# EAGLE design PowerManagementMysensors2 (EAGLE 6.5.0)
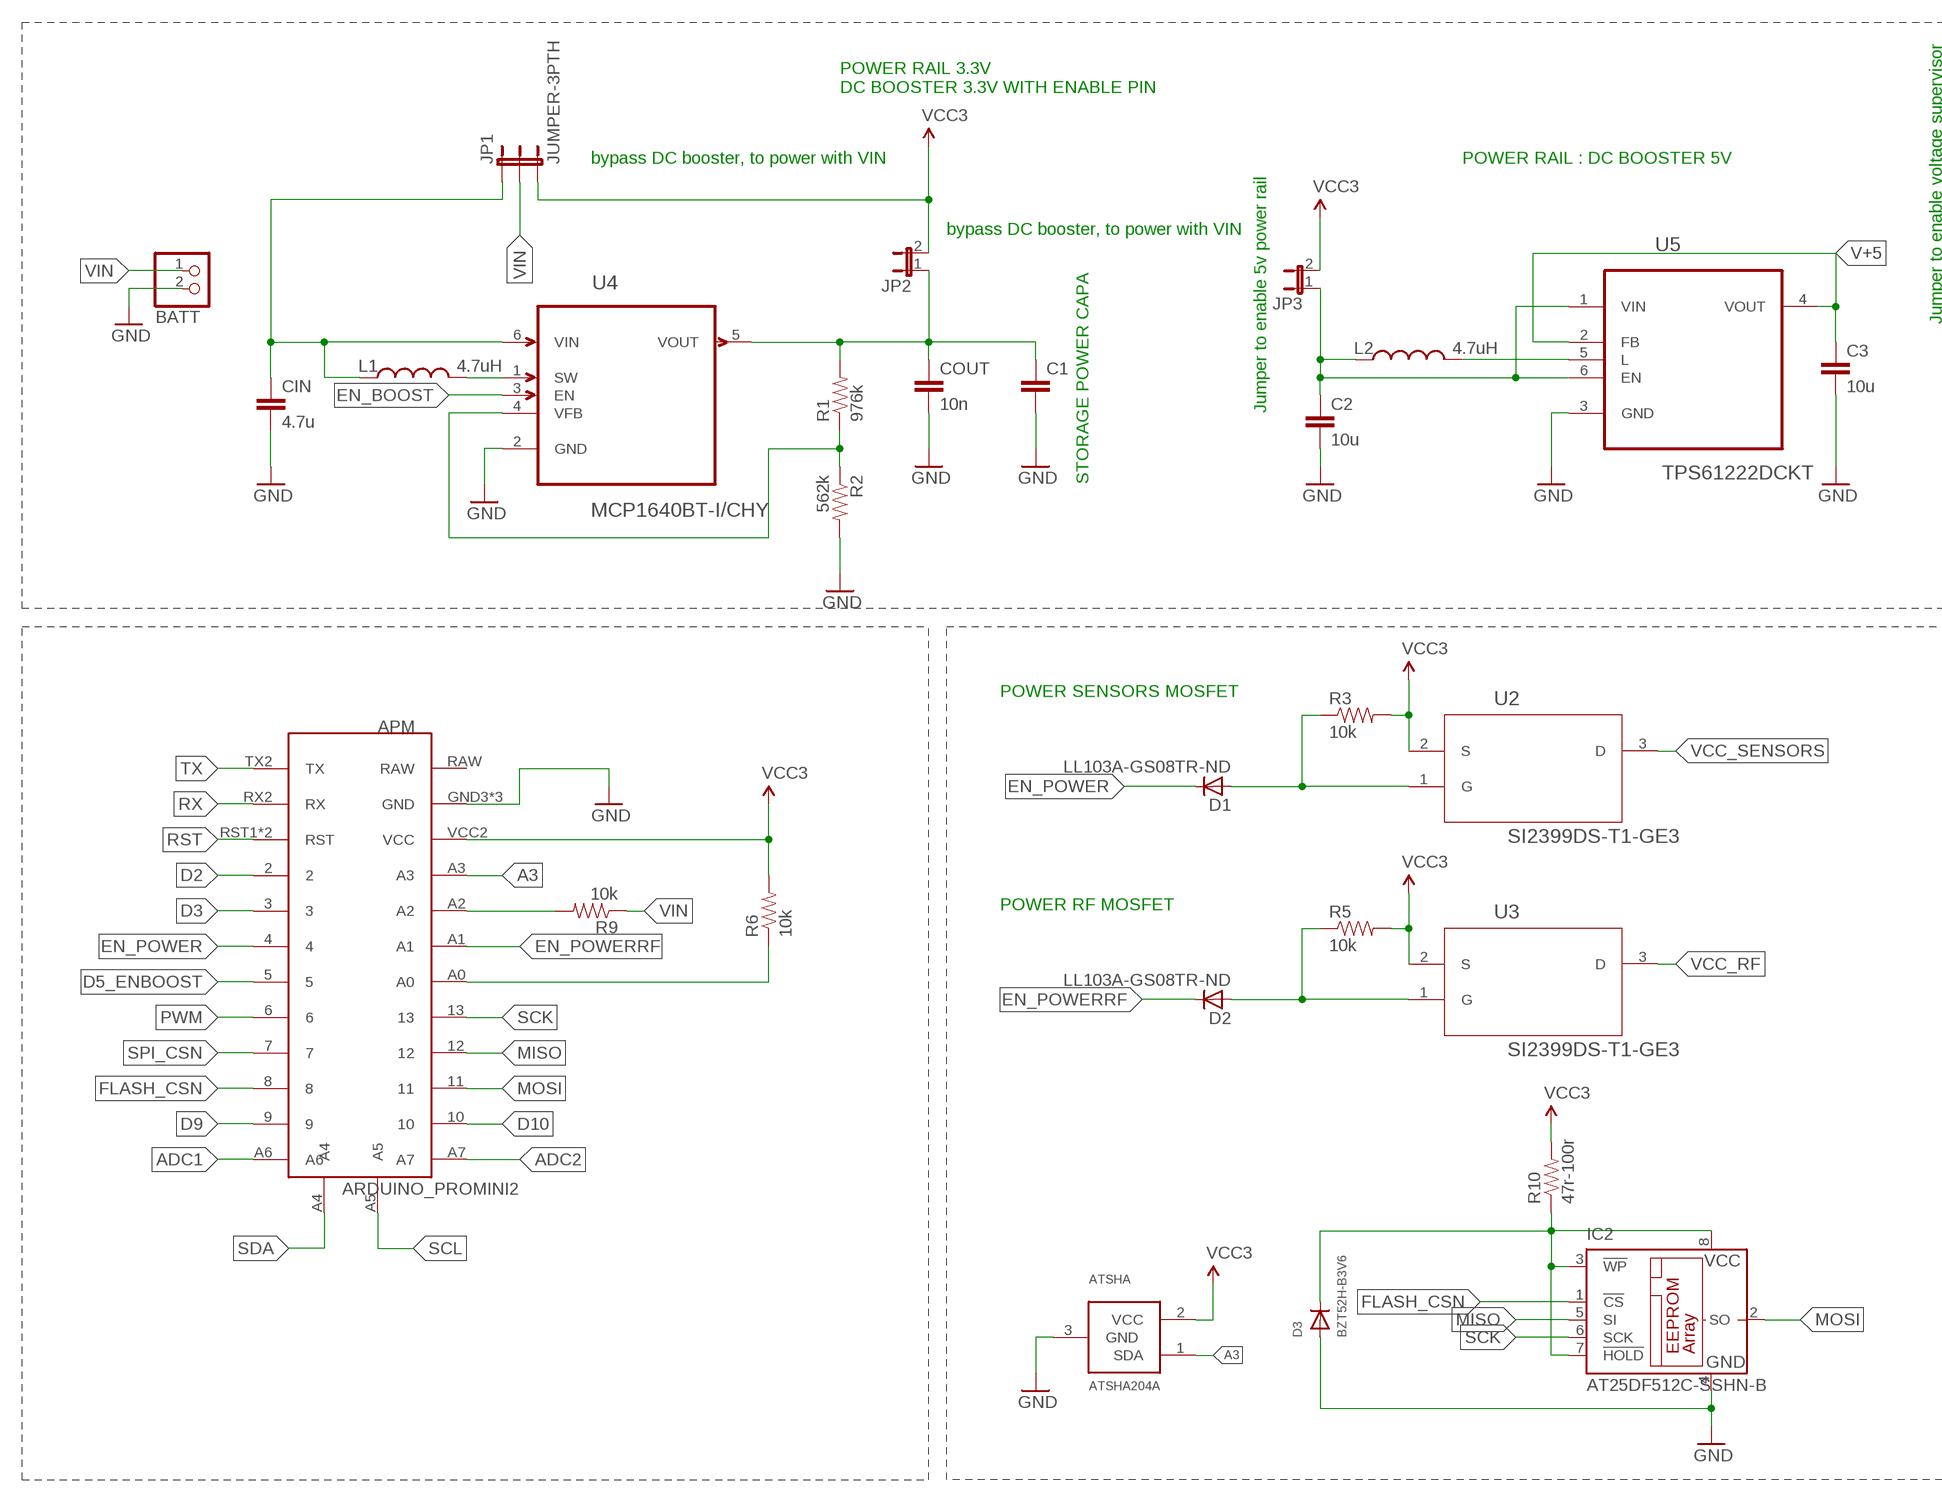
[diagram p0: schematic, sheet 1, part 1 of 2]
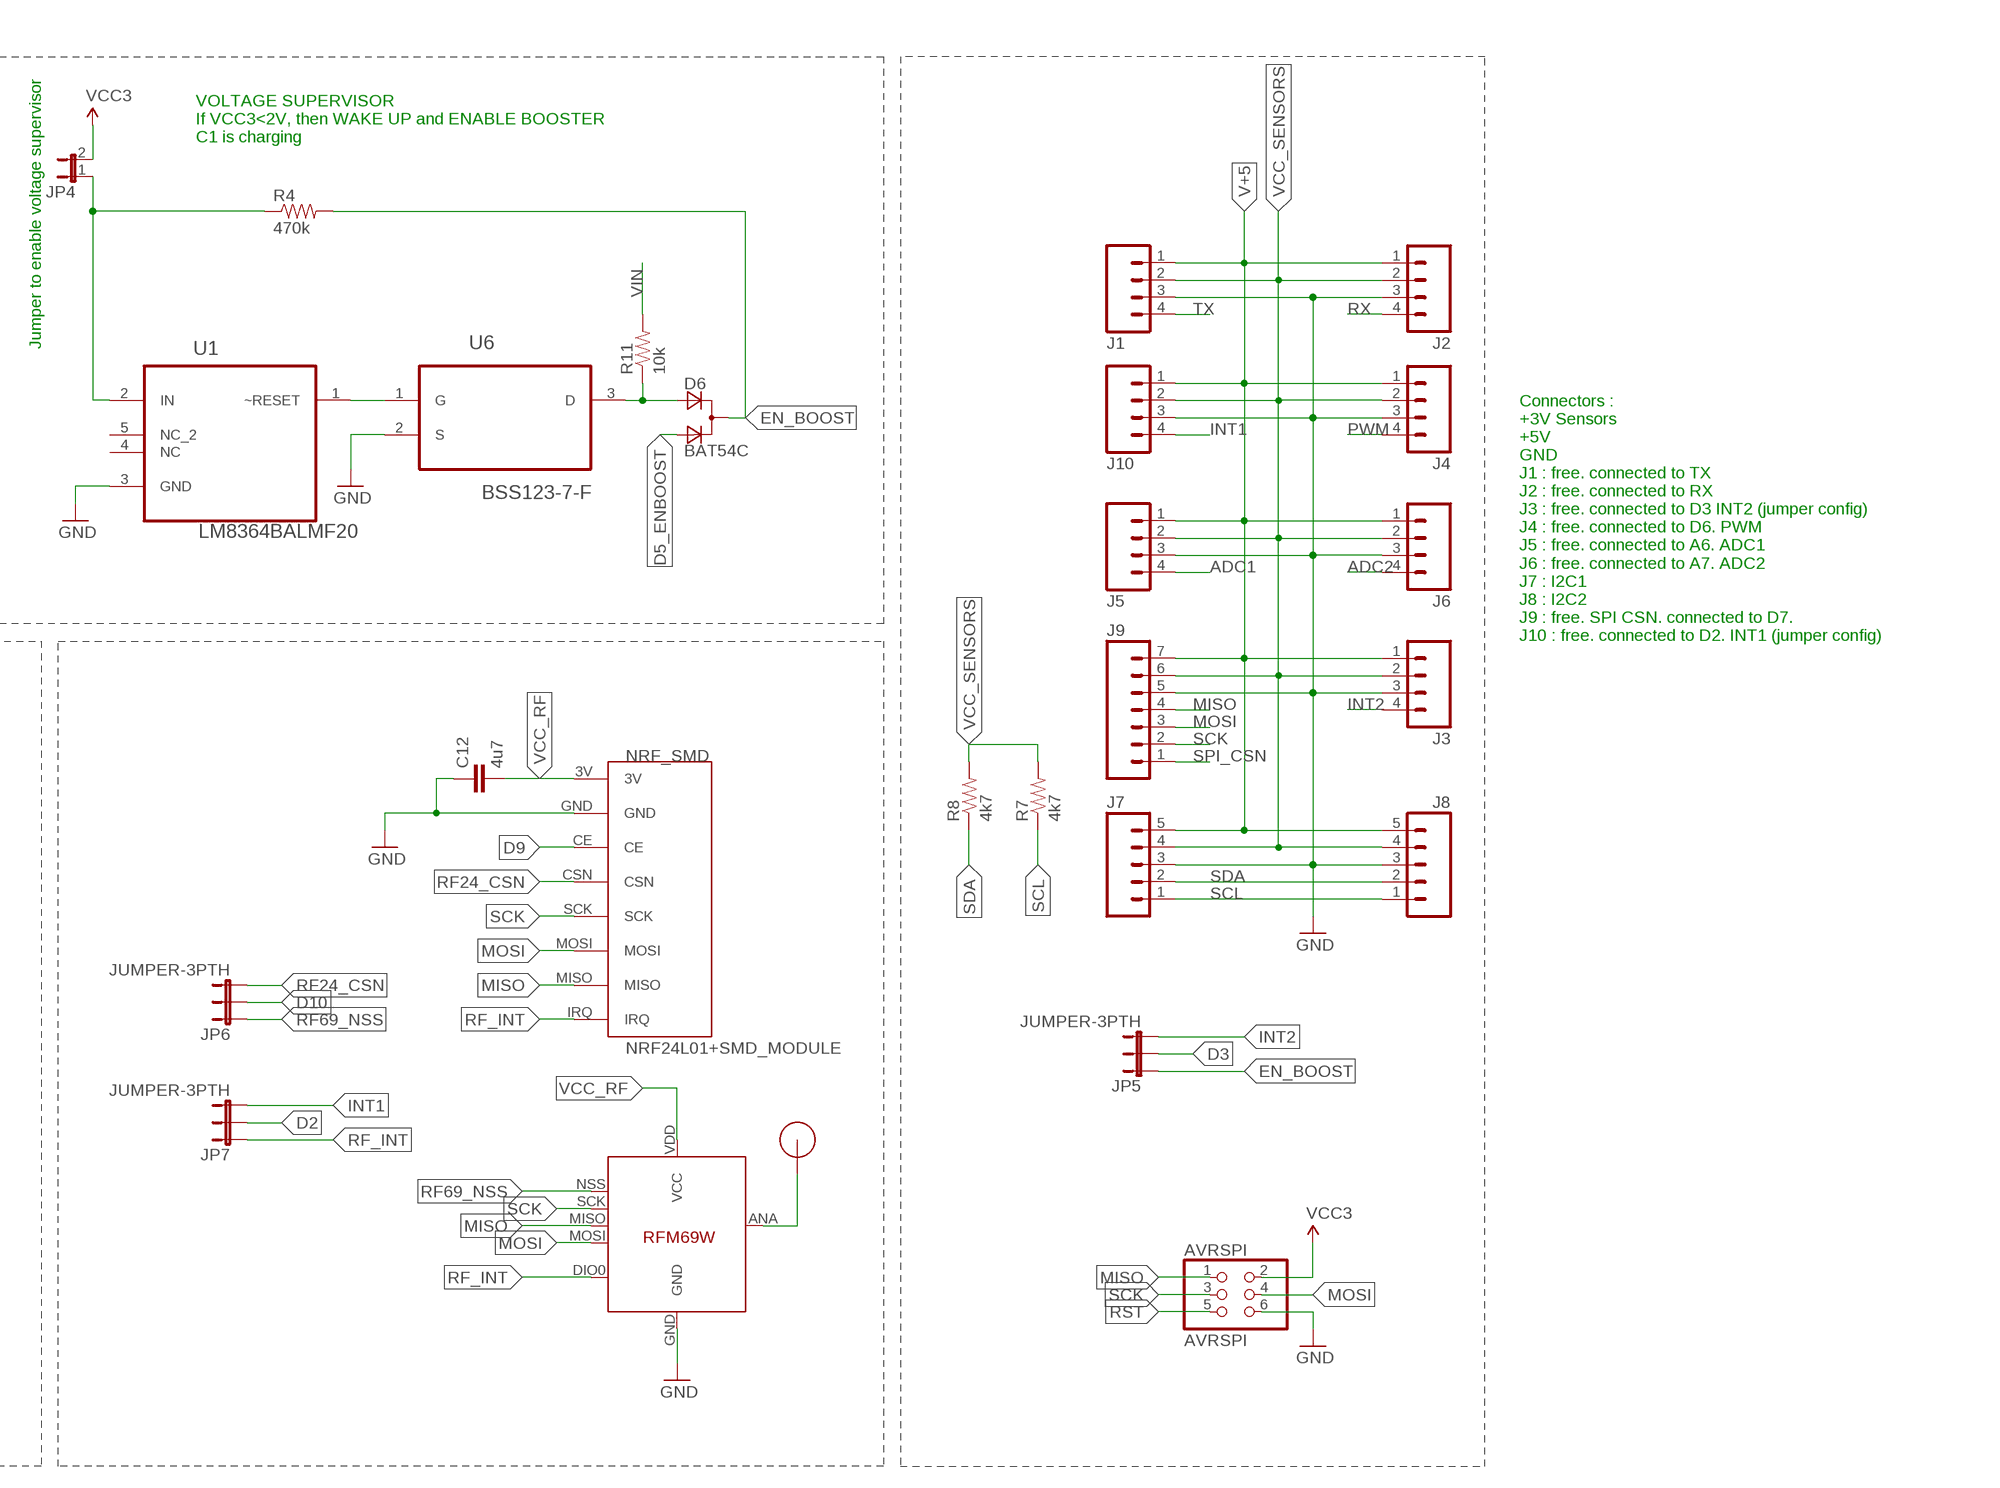
[diagram p1: schematic, sheet 1, part 2 of 2]

## Parts
ANT  RFM12B_ANTENNA  [RFM12B-ANTENNA]
APM  ARDUINO_PROMINI2  [ARDUINO_PROMINI2]
ATSHA  ATSHA204A  [SOT23]
AVRSPI  AVRSPI  PINHD-2X3  [2X03]
BATT  JST_2PIN-THM  [JST-PH-2-THM]
C1  CAP1206  [1206]
C2  10u  CAP1206  [1206]
C3  10u  CAP1206  [1206]
C12  4u7  CAP1206  [1206]
CIN  4.7u  CAP1206  [1206]
COUT  10n  CAP1206  [1206]
D1  LL103A-GS08TR-ND  D-SOD-80  [SOD80]
D2  LL103A-GS08TR-ND  D-SOD-80  [SOD80]
D3  BZT52H-B3V6  DIODESOD-123  [SOD-123]
D6  BAT54C  D_2ASOT23  [SOT-23]
IC2  AT25DF512C-SSHN-B  25AA080SN  [SO-08]
J1  M041X04_NO_SILK  [1X04_NO_SILK]
J2  M041X04_NO_SILK  [1X04_NO_SILK]
J3  M041X04_NO_SILK  [1X04_NO_SILK]
J4  M041X04_NO_SILK  [1X04_NO_SILK]
J5  M041X04_NO_SILK  [1X04_NO_SILK]
J6  M041X04_NO_SILK  [1X04_NO_SILK]
J7  M05NO_SILK  [1X05_NO_SILK]
J8  M05NO_SILK  [1X05_NO_SILK]
J9  M07  [1X07]
J10  M041X04_NO_SILK  [1X04_NO_SILK]
JP1  JUMPER-3PTH  [1X03]
JP2  JUMPER-2PTH  [1X02]
JP3  JUMPER-2PTH  [1X02]
JP4  JUMPER-2PTH  [1X02]
JP5  JUMPER-3PTH  [1X03]
JP6  JUMPER-3PTH  [1X03]
JP7  JUMPER-3PTH  [1X03]
L1  4.7uH  INDUCTOR0805  [0805]
L2  4.7uH  INDUCTOR0805  [0805]
NRF_SMD  NRF24L01+SMD_MODULE  [NRF24L01+SMD_MODULE]
R1  976k  RESISTOR1206  [1206]
R2  562k  RESISTOR1206  [1206]
R3  10k  RESISTOR1206  [1206]
R4  470k  RESISTOR1206  [1206]
R5  10k  RESISTOR1206  [1206]
R6  10k  RESISTOR1206  [1206]
R7  4k7  RESISTOR1206  [1206]
R8  4k7  RESISTOR1206  [1206]
R9  10k  RESISTOR1206  [1206]
R10  47r-100r  RESISTOR1206  [1206]
R11  10k  RESISTOR1206  [1206]
RFM69  RFM69  [RFM69W-MINPADS]
U1  LM8364BALMF20  [SOT95P284X122-5N]
U2  SI2399DS-T1-GE3  [SOT95P237X112-3N]
U3  SI2399DS-T1-GE3  [SOT95P237X112-3N]
U4  MCP1640BT-I/CHY  [SOT95P270X145-6N]
U5  TPS61222DCKT  [SOT65P210X110-6N]
U6  BSS123-7-F  [SOT95P240X110-3N]

## Nets
A3: APM.A3 ATSHA.1(SDA)
ADC1: APM.A6 J5.4
ADC2: APM.A7 J6.4
D2: APM.2 JP7.2
D3: APM.3 JP5.2
D5_ENBOOST: APM.5 D6.3(A2)
D9: APM.9 NRF_SMD.CE
D10: APM.10 JP6.2
EN_BOOST: D6.1(C) JP5.1 R4.2 U4.3(EN)
EN_POWER: APM.4 D1.1(C)
EN_POWERRF: APM.A1 D2.1(C)
FLASH_CSN: APM.8 IC2.1(!CS)
GND: APM.GND3(GND) APM.GND4(GND) APM.GND5(GND) ATSHA.3(GND) AVRSPI.6 BATT.2 C1.2 C2.2 C3.2 C12.1 CIN.2 COUT.2 D3.A IC2.4(GND) J1.3 J2.3 J3.3 J4.3 J5.3 J6.3 J7.3 J8.3 J9.5 J10.3 NRF_SMD.GND R2.2 RFM69.GND U1.3(GND) U4.2(GND) U5.3(GND) U6.2(S)
INT1: J10.4 JP7.3
INT2: J3.4 JP5.3
MISO: APM.12 AVRSPI.1 IC2.5(SI) J9.4 NRF_SMD.MISO RFM69.MISO
MOSI: APM.11 AVRSPI.4 IC2.2(SO) J9.3 NRF_SMD.MOSI RFM69.MOSI
N$1: L1.2 U4.1(SW)
N$2: ANT.P$1 RFM69.ANA(ANT)
N$4: R1.1 R2.1 U4.4(VFB)
N$5: U1.1(~RESET) U6.1(G)
N$6: D3.C IC2.3(!WP) IC2.7(!HOLD) IC2.8(VCC) R10.1
N$7: D1.2(A) R3.1 U2.1(G)
N$8: C1.1 COUT.1 JP2.1 R1.2 U4.5(VOUT)
N$9: JP4.1 R4.1 U1.2(IN)
N$10: L2.2 U5.5(L)
N$11: APM.A0 R6.1
N$13: C2.1 JP3.1 L2.1 U5.1(VIN) U5.6(EN)
N$14: APM.A2 R9.2
N$17: D6.2(A1) R11.1 U6.3(D)
N$18: D2.2(A) R5.1 U3.1(G)
PWM: APM.6 J4.4
RF24_CSN: JP6.3 NRF_SMD.CSN
RF69_NSS: JP6.1 RFM69.NSS(SEL)
RF_INT: JP7.1 NRF_SMD.IRQ RFM69.DIO0
RST: APM.RST1(RST) APM.RST2(RST) AVRSPI.5
RX: APM.RX2(RX) J2.4
SCK: APM.13 AVRSPI.3 IC2.6(SCK) J9.2 NRF_SMD.SCK RFM69.SCK
SCL: APM.A5 J7.1 J8.1 R7.1
SDA: APM.A4 J7.2 J8.2 R8.1
SPI_CSN: APM.7 J9.1
TX: APM.TX2(TX) J1.4
V+5: C3.1 J1.1 J2.1 J3.1 J4.1 J5.1 J6.1 J7.5 J8.5 J9.7 J10.1 U5.2(FB) U5.4(VOUT)
VCC: APM.VCC2(VCC) ATSHA.2(VCC) AVRSPI.2 JP1.3 JP2.2 JP3.2 JP4.2 R3.2 R5.2 R6.2 R10.2 U2.2(S) U3.2(S) ; supply symbol labelled VCC3
VCC_RF: C12.2 NRF_SMD.3V RFM69.VDD(VCC) U3.3(D)
VCC_SENSORS: J1.2 J2.2 J3.2 J4.2 J5.2 J6.2 J7.4 J8.4 J9.6 J10.2 R7.2 R8.2 U2.3(D)
VIN: BATT.1 JP1.2 R9.1 R11.2
VIN2: CIN.1 JP1.1 L1.1 U4.6(VIN)
Unconnected: APM.RAW U1.4(NC) U1.5(NC_2)

## Notes on the sheet
- POWER RAIL 3.3V
  DC BOOSTER 3.3V WITH ENABLE PIN
- VOLTAGE SUPERVISOR
  If VCC3<2V, then WAKE UP and ENABLE BOOSTER
  C1 is charging
- bypass DC booster, to power with VIN | POWER RAIL : DC BOOSTER 5V
- bypass DC booster, to power with VIN
- Jumper to enable voltage supervisor
- Jumper to enable 5v power rail
- STORAGE POWER CAPA
- Connectors :
  +3V Sensors
  +5V
  GND
  J1 : free. connected to TX
  J2 : free. connected to RX
  J3 : free. connected to D3 INT2 (jumper config)
  J4 : free. connected to D6. PWM
  J5 : free. connected to A6. ADC1
  J6 : free. connected to A7. ADC2
  J7 : I2C1
  J8 : I2C2
  J9 : free. SPI CSN. connected to D7.
  J10 : free. connected to D2. INT1 (jumper config)
- POWER SENSORS MOSFET
- POWER RF MOSFET

## Library data of the parts
ANT = LowPowerLab:RFM12B_ANTENNA
APM = pmo_lib:ARDUINO_PROMINI2
ATSHA = Sensor_tbowmo:ATSHA204A
AVRSPI = pinhead:PINHD-2X3: PIN HEADER
BATT = adafruit:JST_2PIN: JST 2-Pin Connectors of various flavors SMT-RA (S2B-PH-SM4) 4UConnector #17311 SMT (B2B-PH-SM4) THM-RA (S2B-PH) THM (B2B-PH)
C1-C3 CIN COUT = SparkFun-Passives:CAP: Capacitor Standard 0603 ceramic capacitor, and 0.1" leaded capacitor.
C12 = SparkFun-Capacitors:CAP: Capacitor Standard 0603 ceramic capacitor, and 0.1" leaded capacitor.
D1 D2 = semicon-smd-ipc:D-: DIODE unfilled
D3 = adafruit:DIODE: Diode SMADIODE - SMA Surface Mount Package 20V 1A Schottky Diode Digikey: 641-1014-6-ND DO-1N4148 - Through Hole Small Current Diode SOD-123 20V 1 A (.5mV Vf) Schottky Diode - Digikey: MBRX120TPMSCT-ND SOD-323 10V 570mA (.38mV Vf, 3ns) Schottky Diode - Digikey: ZLLS410CT-ND SOD-523 30V 30mA Schottky Diode (RB751S-40TE61) - Digikey: RB751S-40TE61CT-ND SOT23-R/W - SOT23 Package (R = Solder Paste/Reflow Ovens, W = Hand-Soldering) BAT54Film 40V 300mA - Digikey: 497-7162-1-ND
D6 = zetex:D_2A: Dual DIODE; OC_FARNELL: unknown; OC_NEWARK: unknown
IC2 = microchip:25*: Serial EEPROM 4K/ 8K , SPI bus; MF: MICROCHIP; MPN: 25AA080/SN; OC_FARNELL: 1816072; OC_NEWARK: 92C7351
J1-J6 J10 = SparkFun-Connectors:M04: Header 4 Standard 4-pin 0.1" header. Use with straight break away headers (SKU : PRT-00116), right angle break away headers (PRT-00553), swiss pins (PRT-00743), machine pins (PRT-00117), and female headers (PRT-00115). Molex polarized connector foot print use with SKU : PRT-08231 with associated crimp pins and housings. 1MM SMD Version SKU: PRT-10208
J7 J8 = SparkFun-Connectors:M05: Header 5 Standard 5-pin 0.1" header. Use with straight break away headers (SKU : PRT-00116), right angle break away headers (PRT-00553), swiss pins (PRT-00743), machine pins (PRT-00117), and female headers (PRT-00115). Molex polarized connector foot print use with SKU : PRT-08230 with associated crimp pins and housings.
J9 = SparkFun-Connectors:M07: Header 7 Standard 7-pin 0.1" header. Use with straight break away headers (SKU : PRT-00116), right angle break away headers (PRT-00553), swiss pins (PRT-00743), machine pins (PRT-00117), and female headers (PRT-00115). NOTES ON THE VARIANTS LOCK and LOCK_LONGPADS... This footprint was designed to help hold the alignment of a through-hole component (i.e. 7-pin header) while soldering it into place. You may notice that each hole has been shifted either up or down by 0.005 of an inch from it's more standard position (which is usually a perfectly straight line). This slight alteration caused the pins (the squares in the middle) to touch the edges of the holes. Because they are alternating, it causes a "brace" to hold the header in place. 0.005 has proven to be the perfect amount of "off-center" position when using our standard breakaway headers. Although looks a little odd when you look at the bare footprint, once you have a header in there, the alteration is very hard to notice. Also, if you push a header all the way into place, it is covered up entirely on the bottom side. This idea of altering the position of holes to aid alignment will be further integrated into the Sparkfun Library for other footprints. It can help hold any component with 3 or more connection pins.
JP1 JP5-JP7 = SparkFun-Passives:JUMPER-3
JP2-JP4 = SparkFun-Passives:JUMPER-2: Jumper Basic 0.1" spaced jumper. Use with breakaway headers.
L1 L2 = SparkFun-Passives:INDUCTOR: Inductors Basic Inductor/Choke - 0603 and 1206. Footprints are not proven and vary greatly between part numbers. SRN6045- 33uH, 20% 1.4A SDR0403-560KL - 56uH, 10%, 500mA RMS/740mA peak
NRF_SMD = pmo_lib:NRF24L01+SMD_MODULE
R1-R11 = SparkFun-Passives:RESISTOR: Resistor Basic schematic elements and footprints for 0603, 1206, and PTH resistors.
RFM69 = LowPowerLab:RFM69
U1 = pmo_lib:LM8364BALMF20: Micropower Undervoltage Sensing Circuits; MPN: LM8364BALMF20; OC_FARNELL: 9779485; OC_NEWARK: 41K6417; PACKAGE: SOT23-5; SUPPLIER: National Semiconductor
U2 U3 = pmo_lib:SI2399DS-T1-GE3: P-Channel 20-V (D-S) MOSFET; MPN: SI2399DS-T1-GE3; OC_FARNELL: 2056681; OC_NEWARK: 64T4058; PACKAGE: SOT-23-3; SUPPLIER: VISHAY SILICONIX
U4 = pmo_lib:MCP1640BT-I/CHY: Synchronous Boost Regulator; MPN: MCP1640BT-I/CHY; OC_FARNELL: 1800207; OC_NEWARK: 73R3625; PACKAGE: SOT-6; SUPPLIER: Microchip
U5 = pmo_lib:TPS61222DCKT: LOW INPUT VOLTAGE STEP-UP CONVERTER; MPN: TPS61222DCKT; OC_FARNELL: 1755643; OC_NEWARK: 94T5101; PACKAGE: SC70-6; SUPPLIER: Texas Instruments
U6 = pmo_lib:BSS123-7-F: MODE FIELD EFFECT TRANSISTOR; MPN: BSS123-7-F; OC_FARNELL: 1843725; OC_NEWARK: 12T1440; PACKAGE: SOT-23-3; SUPPLIER: DIODES INC.

## Net classes
1 Power: width 0.406 mm

## Board
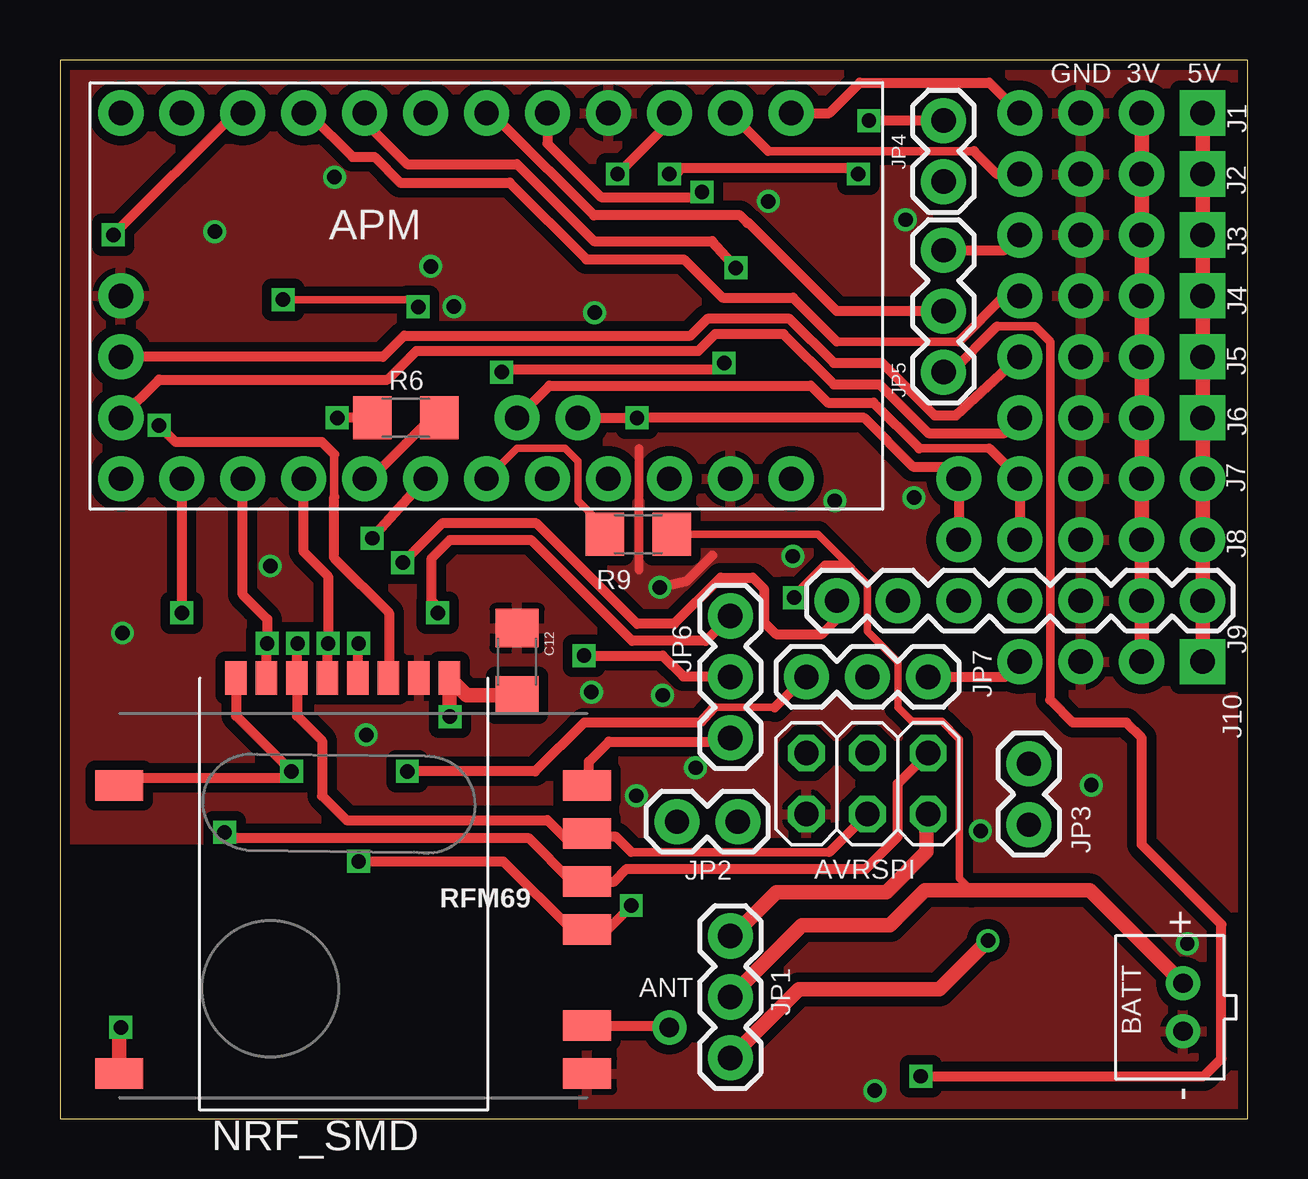
[diagram p2: board, top side]
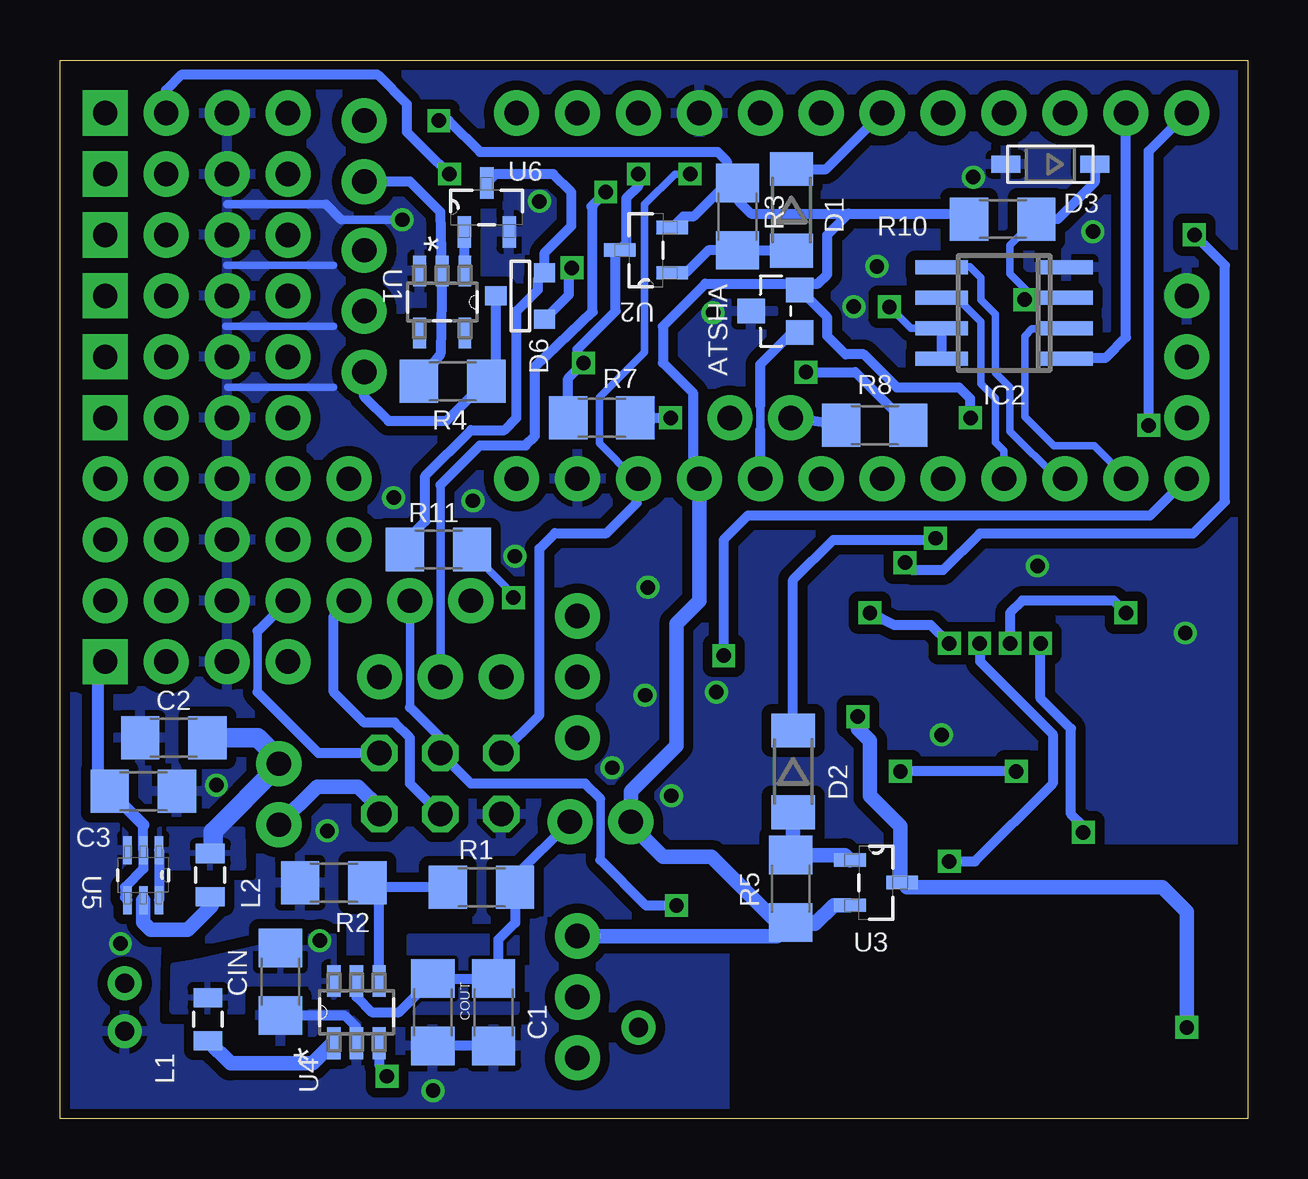
[diagram p3: board, bottom side, seen from below]

Size 49.51 x 44.12 mm. Coordinates in mm from the lower left corner, seen from the top.
Outline: 0,0 49.51,0 49.51,44.12 0,44.12 0,0
Copper layers (1*16): Top 0.0356mm / dielectric 1.5011mm / Bottom 0.0356mm
Design rules "LaenPCBOrder": minimum track width 6mil, minimum drill 13mil, track to track 6mil, track to pad 6mil, pad to pad 6mil, via to via 6mil, smd to smd 6mil, copper to edge 15mil, drill to drill 6mil, minimum pad ring 7mil, minimum via ring 7mil, stop-mask expansion 3mil, vias tented up to drill 0mil, thermal gap 10mil

### Footprints (pad centres in the part's own frame; a part is rotated, then mirrored left to right if it is on the bottom)
RFM12B-ANTENNA = drill 0.8 pad 1.422: P$1 0,0
ARDUINO_PROMINI2 = drill 1.016 pad 1.88: 2 -7.62,2.54; 3 -7.62,0; 4 -7.62,-2.54; 5 -7.62,-5.08; 6 -7.62,-7.62; 7 -7.62,-10.16; 8 -7.62,-12.7; 9 -7.62,-15.24; 10 7.62,-15.24; 11 7.62,-12.7; 12 7.62,-10.16; 13 7.62,-7.62; A0 7.62,-5.08; A1 7.62,-2.54; A2 7.62,0; A3 7.62,2.54; A4 5.08,1.27; A5 5.08,3.81; A6 2.54,-15.24; A7 5.08,-15.24; GND3 -7.62,5.08; GND4 7.62,10.16; GND5 0,-15.24; RAW 7.62,12.7; RST1 -7.62,7.62; RST2 7.62,7.62; RX2 -7.62,10.16; TX2 -7.62,12.7; VCC2 7.62,5.08
SOT23 = smd 1.016 x 1.143: 1 -0.889,-1.016; 2 0.889,-1.016; 3 0,1.016
2X03 = drill 1.016 octagon: 1 -2.54,-1.27; 2 -2.54,1.27; 3 0,-1.27; 4 0,1.27; 5 2.54,-1.27; 6 2.54,1.27
JST-PH-2-THM = drill 0.8 pad 1.422: 1 1,0; 2 -1,0
1206 = smd 1.6 x 1.8: 1 -1.4,0; 2 1.4,0
SOD80 = smd 1.4 x 1.8: 1 -1.7,0; 2 1.7,0
SOD-123 = smd 1.2 x 0.7: A 1.85,0; C -1.85,0
SOT-23 = smd 0.787 x 0.889: 1 0.025,-1.016; 2 -0.94,1.016; 3 0.991,1.016
SO-08 = smd 0.6 x 2.2: 1 -1.905,-2.6; 2 -0.635,-2.6; 3 0.635,-2.6; 4 1.905,-2.6; 5 1.905,2.6; 6 0.635,2.6; 7 -0.635,2.6; 8 -1.905,2.6
1X04_NO_SILK = drill 1.016 pad 1.88 square: 1 0,0 | drill 1.016 pad 1.88: 2 2.54,0; 3 5.08,0; 4 7.62,0
1X05_NO_SILK = drill 1.016 pad 1.88: 1 0,0; 2 2.54,0; 3 5.08,0; 4 7.62,0; 5 10.16,0
1X07 = drill 1.016 pad 1.88: 1 0,0; 2 2.54,0; 3 5.08,0; 4 7.62,0; 5 10.16,0; 6 12.7,0; 7 15.24,0
1X03 = drill 1.016 pad 1.88: 1 0,0; 2 2.54,0; 3 5.08,0
1X02 = drill 1.016 pad 1.88: 1 0,0; 2 2.54,0
0805 = smd 0.8 x 1.2: 1 -0.9,0; 2 0.9,0
NRF24L01+SMD_MODULE = smd 0.9 x 1.4: 3V -4.8,-9.6; CE -2.26,-9.6; CSN -0.99,-9.6; GND -3.53,-9.6; IRQ 4.09,-9.6; MISO 2.82,-9.6; MOSI 1.55,-9.6; SCK 0.28,-9.6
RFM69W-MINPADS = smd 2 x 1.27: ANA 8,-5; DIO0 -11.5,5; GND 8,-7; MISO 8,1; MOSI 8,3; NSS 8,5; SCK 8,-1; VDD -11.5,-7
SOT95P284X122-5N = smd 1.27 x 0.533: 1 -1.295,0.94; 2 -1.295,0; 3 -1.295,-0.94; 4 1.295,-0.94; 5 1.295,0.94
SOT95P237X112-3N = smd 1.321 x 0.559: 1 -1.092,0.94; 2 -1.092,-0.94; 3 1.092,0
SOT95P270X145-6N = smd 1.321 x 0.559: 1 -1.295,0.94; 2 -1.295,0; 3 -1.295,-0.94; 4 1.295,-0.94; 5 1.295,0; 6 1.295,0.94
SOT65P210X110-6N = smd 1.168 x 0.356: 1 -1.041,0.66; 2 -1.041,0; 3 -1.041,-0.66; 4 1.041,-0.66; 5 1.041,0; 6 1.041,0.66
SOT95P240X110-3N = smd 1.321 x 0.559: 1 -1.016,0.94; 2 -1.016,-0.94; 3 1.016,0

### Placement (x,y rotation side)
ANT  25.4,3.81 0 top
APM  17.78,34.29 270 top
ATSHA  19.68,33.66 90 bottom
AVRSPI  33.66,13.97 180 top
BATT  46.81,4.65 90 top
C1  31.43,4.45 270 bottom
C2  44.77,15.88 180 bottom
C3  46.04,13.65 0 bottom
C12  19.05,19.05 270 top
CIN  40.32,5.71 270 bottom
COUT  33.97,4.45 270 bottom
D1  19.02,37.87 270 bottom
D2  18.95,14.48 270 bottom
D3  8.23,39.78 180 bottom
D6  30.33,34.32 270 bottom
IC2  10.16,33.58 90 bottom
J1  47.62,41.91 180 top
J2  47.62,39.37 180 top
J3  47.62,36.83 180 top
J4  47.62,34.29 180 top
J5  47.62,31.75 180 top
J6  47.62,29.21 180 top
J7  37.47,26.67 0 top
J8  37.47,24.13 0 top
J9  32.38,21.59 0 top
J10  47.62,19.05 180 top
JP1  27.94,2.54 90 top
JP2  28.26,12.38 180 top
JP3  40.39,14.8 270 top
JP4  36.83,39.05 90 top
JP5  36.83,31.11 90 top
JP6  27.94,15.88 90 top
JP7  31.11,18.41 0 top
L1  43.35,4.15 270 bottom
L2  43.24,10.16 270 bottom
NRF_SMD  11.43,8.76 180 top
R1  31.94,9.65 0 bottom
R2  38.1,9.84 180 bottom
R3  21.27,37.59 90 bottom
R4  33.15,30.73 0 bottom
R5  19.05,9.59 270 bottom
R6  14.41,29.21 180 top
R7  26.92,29.21 180 bottom
R8  15.54,28.91 0 bottom
R9  24.1,24.36 180 top
R10  10.21,37.49 180 bottom
R11  33.73,23.72 0 bottom
RFM69  13.97,8.89 0 top
U1  33.58,34.04 270 bottom
U2  25.08,36.2 180 bottom
U3  15.49,9.84 0 bottom
U4  37.15,4.45 90 bottom
U5  46.04,10.16 270 bottom
U6  31.72,37.97 90 bottom

### Tracks (layer width: path | path; a pad name or v marks a point on that pad's centre or on a via)
A3
  Bottom 0.356: 20.32,28.7 20.32,29.72
  Bottom 0.406: ATSHA.1 18.99,32.77 20.32,31.43 20.32,29.72 | APM.A3 20.32,28.7
ADC1
  Top 0.406: APM.A6 13.46,31.75 14.35,32.64 26.29,32.64 26.99,33.34 30.42,33.34 32.26,31.5 34.27,31.5 36.45,29.31 37.36,29.31 J5.4
ADC2
  Top 0.406: J6.4 39.37,28.57 36.2,28.57 34.16,30.61 32.26,30.61 30.16,32.7 27.3,32.7 26.61,32 14.86,32 13.65,30.8 4.13,30.8 APM.A7
D2  (via drill 0.6)
  Top 0.406: APM.2 20.32,40.64 22.55,38.41 26.54,38.41 v26.76,38.62
  Bottom 0.356: JP7.2 33.66,26.42
  Bottom 0.406: v26.76,38.62 27.36,38.02 27.3,38.02 27.3,33.63 29.72,31.34 29.72,28.45 30.1,28.07 32,28.07 33.66,26.42
D3
  Top 0.406: JP5.2 32.38,33.66 28.7,37.34 28.65,37.34 28.35,37.64 22.25,37.64 18.44,41.45 18.24,41.45 APM.3
D5_ENBOOST  (via drill 0.6)
  Top 0.406: APM.5 12.7,41.55 14.48,39.78 19.05,39.78 22.25,36.58 27.18,36.58 v28.17,35.46
  Bottom 0.406: D6.3 28.3,34.34 28.3,35.33 v28.17,35.46
D9  (via drill 0.6)
  Top 0.356: 11.43,25.91 11.43,27.69
  Top 0.406: 11.43,27.69 10.92,28.19 4.83,28.19 v4.13,28.89 | 11.43,25.91 11.43,23.37 13.72,21.08 13.72,18.39 NRF_SMD.CE
  Bottom 0.406: v4.13,28.89 4.13,40.32 APM.9
D10  (via drill 0.6)
  Top 0.406: v21.84,19.3 25.12,19.3 25.98,18.44 27.91,18.44 JP6.2
  Bottom 0.406: APM.10 4.06,25.15 20.83,25.15 21.84,24.13 v21.84,19.3
EN_BOOST  (via drill 0.6)
  Top 0.356: 41.27,17.46 41.27,32.38 40.64,33.02 39.05,33.02
  Top 0.406: 41.27,17.46 42.23,16.51 44.45,16.51 45.09,15.88 45.09,11.43 48.41,8.1 48.41,2.52 47.68,1.78 v35.88,1.78 | JP5.1 37.15,31.11 39.05,33.02
  Bottom 0.406: U4.3 36.21,2.23 v35.88,1.78 | JP5.1 36.83,30.1 35.81,29.08 33.4,29.08 R4.2 31.34,31.14 D6.1
EN_POWER
  Bottom 0.406: 15.3,41.85 APM.4 | 15.04,41.71 APM.4 | D1.1 17.58,39.57 APM.4
EN_POWERRF  (via drill 0.6)
  Top 0.406: APM.A1 v13.02,24.19
  Bottom 0.406: v13.02,24.19 13.08,24.13 17.27,24.13 18.95,22.45 D2.1
FLASH_CSN
  Bottom 0.406: APM.8 5.08,32.56 5.94,31.7 7.54,31.7 IC2.1
GND  (via drill 0.6)
  Top 0.356: 24.13,27.94 24.13,22.86
  Top 0.406: v25.01,22.15 26.14,22.43 27.18,23.47
  Bottom 0.305: 38.1,35.56 42.57,35.56 | 38.1,33.02 42.6,33.02 | 38.1,30.48 42.52,30.48
  Bottom 0.356: v35.24,37.47 37.78,37.47 | 38.42,38.1 42.55,38.1
  Bottom 0.406: CIN.2 37.65,4.32 37.15,3.81 U4.2 | C1.2 COUT.2 | 37.78,37.47 38.42,38.1
  other vias: 33.96,1.18 46.99,7.3 42.99,13.91 15.46,35.52 22.29,33.59 11.44,39.24 6.45,36.97 12.76,16 38.37,12 8.76,23.04 32.3,25.76 25.12,17.65 22.15,17.78 24.03,13.46 26.49,14.63 16.42,33.85 30.54,23.44 2.6,20.24 29.53,38.23 35.6,25.88
  pour Bottom (isolate 0.406, rank 6): -3.81,48.26 54.61,48.26 54.61,-5.08 -3.81,-5.08
  pour Top (isolate 0.406, rank 6): -1.27,45.72 52.07,45.72 52.07,-2.54 -1.27,-2.54
INT1
  Top 0.406: JP7.3 39.37,18.41 J10.4
INT2
  Top 0.406: JP5.3 39.37,36.2 J3.4
MISO  (via drill 0.6)
  Top 0.406: APM.12 7.62,21.84 8.64,20.83 v8.64,19.81 8.61,19.79 NRF_SMD.MISO | AVRSPI.1 34.92,13.97 34.92,11.75 33.59,10.41 23.62,10.41 23.1,9.89 RFM69.MISO 21.35,9.89 19.56,11.68 7.11,11.68 v6.86,11.94
  Bottom 0.305: APM.12 7.92,26.67 9.91,28.65 9.91,30.48 10.52,31.09 10.52,33.53 11.12,34.14 11.12,35.05 11.58,35.51 12.73,35.51 IC2.5
  Bottom 0.356: 41.27,17.78 41.27,20.32
  Bottom 0.406: AVRSPI.1 38.73,15.24 41.27,17.78 | 41.27,20.32 J9.4 | v6.86,11.94 6.86,12.19 7.37,12.7 7.37,16.26 8.64,17.53 v8.64,19.81
MOSI  (via drill 0.6)
  Top 0.356: 32.07,11.11 23.81,11.11
  Top 0.406: AVRSPI.4 32.07,11.11 | 22.14,12.06 RFM69.MOSI | 23.81,11.11 23.18,11.75 22.11,11.75 RFM69.MOSI | APM.11 v5.08,21.08 | v9.91,19.81 9.88,19.79 NRF_SMD.MOSI 9.88,16.79 10.92,15.75 10.92,13.46 11.94,12.45 20.32,12.45 21.08,11.68 21.76,11.68 RFM69.MOSI
  Bottom 0.305: APM.11 5.08,26.72 6.4,28.04 8.08,28.04 9.3,29.26 9.3,32.61 8.99,32.92 7.58,32.92 IC2.2
  Bottom 0.406: AVRSPI.4 34.92,13.97 34.92,15.88 35.56,16.51 36.83,16.51 38.1,17.78 38.1,20.95 J9.3 | v5.08,21.08 5.59,21.59 9.4,21.59 9.91,21.08 v9.91,19.81
N$1
  Bottom 0.61: U4.1 38.15,3.15 38.99,2.31 42.4,2.31 L1.2
N$2
  Top 0.406: RFM69.ANA 25.32,3.89 ANT.P$1
N$4
  Bottom 0.406: R1.1 36.51,9.65 R2.1 36.21,9.35 U4.4
N$5
  Bottom 0.406: U1.1 32.64,36.93 U6.1
N$6  (via drill 0.6)
  Top 0.305: v9.3,34.14 14.63,34.14 v14.94,33.83
  Bottom 0.305: IC2.7 14.05,32.94 v14.94,33.83 | 9.22,34.21 9.22,34.52 9.91,35.2 9.91,36.4 R10.1
  Bottom 0.406: D3.C 6.38,39.04 7.92,37.49 R10.1 | IC2.3 9.22,34.21 v9.3,34.14 | IC2.8 IC2.7
N$7
  Bottom 0.406: D1.2 21.25,36.17 R3.1 22.48,36.19 23.37,35.31 23.94,35.31 U2.1
N$8
  Bottom 0.406: U4.5 37.15,5.08 36.51,4.45 35.37,4.45 COUT.1 | COUT.1 C1.1 31.24,6.04 31.24,7.47 30.54,8.17 R1.2 30.54,10.1 JP2.1 | COUT.1 33.97,6.22
N$9
  Bottom 0.406: R4.1 33.66,31.88 U1.2 33.66,37.78 34.92,39.05 JP4.1
N$10
  Bottom 0.61: U5.5 46.04,8.19 45.72,7.87 44.2,7.87 43.18,8.89 43.18,9.2 L2.2
N$11
  Top 0.406: APM.A0 12.95,26.67 15.24,28.96 15.56,28.96 R6.1
N$12
  pour Bottom: 30.48,7.62 30.48,4.45 34.92,4.45 34.92,7.62
N$13
  Bottom 0.406: U5.1 U5.6 | 43.31,15.82 C2.1
  Bottom 0.813: C2.1 41.27,15.88 40.39,14.99 JP3.1 40.39,14.71 43.13,11.96 43.13,11.17 L2.1
  pour Bottom: 41.91,12.06 41.88,10.46 45.31,10.46 45.34,12.06
N$14
  Top 0.305: APM.A2 19.05,27.94 21.06,27.94 21.59,27.41 21.59,25.76 22.33,25.02 22.33,24.91 R9.2
N$15
  cutout Top: 0,11.43 21.59,11.43 21.59,0 0,0
N$16
  cutout Bottom: 0,11.43 21.59,11.43 21.59,0 0,0
N$17
  Bottom 0.406: R11.1 35.13,24.05 34.29,24.89 34.29,26.8 32.38,28.7 30.99,28.7 30.48,29.21 30.48,33.66 29.59,34.54 29.59,34.98 D6.2 29.31,36.09 28.19,37.21 28.19,38.61 28.96,39.37 31.34,39.37 U6.3
N$18
  Bottom 0.61: U3.1 16.79,10.99 R5.1 18.95,11.09 D2.2
PWM
  Top 0.356: 32.38,32.38 37.47,32.38
  Top 0.406: 32.38,32.38 30.56,34.21 27.61,34.21 26.01,35.81 21.95,35.81 18.75,39.01 14.17,39.01 13.11,40.08 12.19,40.08 10.36,41.91 APM.6 | 37.47,32.38 39.37,34.29 J4.4
RF24_CSN  (via drill 0.6)
  Top 0.406: 27.64,20.65 27.71,20.73 | 27.71,20.73 JP6.3 | 27.71,20.73 27.71,20.7 26.92,19.91 23.85,19.91 19.63,24.13 16.26,24.13 15.49,23.37 15.49,21.59 15.75,21.34 v15.75,21.08 | NRF_SMD.CSN 12.42,19.79 v12.45,19.81
  Bottom 0.406: v12.45,19.81 13.21,20.57 14.73,20.57 v15.75,21.08
RF69_NSS
  Top 0.406: RFM69.NSS 22.05,13.97 22.05,14.89 22.89,15.72 27.79,15.72 JP6.1
RF_INT  (via drill 0.6)
  Top 0.305: 27.25,17.14 29.79,17.14
  Top 0.406: 2.54,13.96 RFM69.DIO0 2.8,14.22 9.4,14.22 v9.65,14.48 7.34,16.79 NRF_SMD.IRQ | 27.25,17.14 26.67,16.51 21.84,16.51 19.81,14.48 v14.48,14.48 | 29.79,17.14 JP7.1
  Bottom 0.406: v9.65,14.48 v14.48,14.48
RST  (via drill 0.6)
  Top 0.406: APM.RST1 25.4,41.53 v23.24,39.37
  Bottom 0.305: APM.RST2 25.55,26.67 27.03,28.14 27.03,30.07 25.15,31.95 25.15,38.1 23.88,39.37 v23.24,39.37
  Bottom 0.406: AVRSPI.5 29.53,16.83 29.53,23.76 28.88,24.41 26.72,24.41 25.48,25.65 25.48,26.59 APM.RST2
RX
  Top 0.356: 38.1,40.32 29.53,40.32
  Top 0.406: J2.4 39.05,39.37 38.1,40.32 | 29.53,40.32 APM.RX2
SCK  (via drill 0.6)
  Top 0.406: APM.13 10.16,23.62 11.18,22.61 v11.18,19.81 11.15,19.79 NRF_SMD.SCK | v23.81,8.89 22.81,7.89 RFM69.SCK 21.95,7.87 21.34,7.87 18.48,10.73 v12.45,10.73
  Bottom 0.305: APM.13 10.16,27.84 10.52,28.19 10.52,30.02 11.12,30.63 11.12,33.22 12.04,34.14 12.68,34.14 IC2.6
  Bottom 0.356: 34.92,17.14 J9.2 | 26.99,10.79 26.99,13.34
  Bottom 0.406: 34.92,17.14 33.66,15.88 AVRSPI.3 32.38,13.97 27.62,13.97 26.99,13.34 | v23.81,8.89 25.08,8.89 26.99,10.79 | v11.18,19.81 11.15,19.79 11.15,19.05 8.13,16.03 8.13,13.97 11.37,10.73 v12.45,10.73
SCL  (via drill 0.6)
  Top 0.406: APM.A5 v24.05,29.21 33.53,29.21 35.56,27.18 36.96,27.18 J7.1 J8.1
  Bottom 0.406: R7.1 v24.05,29.21
SDA
  Top 0.356: 35.81,27.94 38.73,27.94
  Top 0.406: APM.A4 20.4,30.56 31.29,30.56 32,29.84 33.91,29.84 35.81,27.94 | J8.2 J7.2 38.73,27.94
  Bottom 0.406: R8.1 APM.A4
SPI_CSN  (via drill 0.6)
  Top 0.406: APM.7 7.3,41.91 v2.22,36.83 | v14.29,23.18 15.93,24.82 19.86,24.82 24.05,20.62 25.6,20.62 27.53,22.55 28.88,22.55 29.34,22.1 29.34,20.7 29.84,20.19 31.75,20.19 32.51,20.95 32.51,21.46 J9.1
  Bottom 0.406: v2.22,36.83 0.95,35.56 0.95,25.72 2.29,24.38 11.18,24.38 12.7,22.86 13.97,22.86 v14.29,23.18
TX
  Top 0.406: APM.TX2 32.07,41.91 33.34,43.18 38.73,43.18 J1.4
V+5
  Top 0.61: J1.1 J2.1 J3.1 J4.1 J5.1 J6.1 J7.5 J8.5 J9.7 J10.1
  Bottom 0.406: U5.4 46.8,9.22 46.8,9.65 46.04,10.41 U5.2 46.04,12.25 | 47.94,14.16 C3.1
  Bottom 0.508: 46.04,12.25 C3.1 | 47.94,14.16 47.94,18.73 J10.1
VCC  (via drill 0.6)
  Top 0.406: R6.2 v11.56,29.21 | JP4.2 v33.72,41.59
  Top 0.61: JP1.3 28.04,7.62 29.87,9.45 34.44,9.45 36.12,11.12 36.12,12.62 AVRSPI.2
  Bottom 0.406: APM.VCC2 23.11,26.92 23.11,30.23 24.38,31.5 24.38,33.02 22.61,34.8 18.92,34.8 | 11.81,37.29 R10.2 | v11.56,29.21 11.58,29.23 11.58,30.02 12.04,30.48 14.63,30.48 16,31.85 16.76,31.85 17.53,32.61 17.53,33.4 ATSHA.2 | v33.72,41.59 33.31,41.59 32,40.29 22.1,40.29 21.71,39.9 21.71,39.43 R3.2 | 23.98,37.15 U2.2 23.53,37.59 23.11,37.59 21.71,38.99 | R3.2 21.71,38.99 | 21.08,38.8 R3.2 | 11.71,37.59 R10.2 | 18.54,34.67 ATSHA.2 | 21.71,38.99 21.71,38.73 20.7,37.72 16.64,37.72 | 16.64,37.72 11.84,37.72 R10.2 | 18.92,34.8 17.91,34.8 17.53,35.18 17.53,36.83 16.64,37.72 | 18.92,34.8 ATSHA.2
  Bottom 0.61: APM.VCC2 22.86,21.59 23.81,20.64 23.81,15.56 25.72,13.65 JP2.2 25.4,12.06 25.4,11.94 24.38,10.92 22.35,10.92 19.81,8.38 19.24,8.38 R5.2 | JP1.3 19.62,7.62 R5.2 | U3.2 17.26,8.9 18.03,8.13 18.99,8.13 R5.2 | AVRSPI.2 36.2,12.95 37.08,13.84 38.8,13.84 JP3.2
VCC_RF  (via drill 0.6)
  Top 0.61: C12.2 16.94,17.65 NRF_SMD.3V 16.23,16.79 v16.26,16.76 | RFM69.VDD 2.47,3.74 v2.54,3.81
  Bottom 0.61: v2.54,3.81 2.54,8.64 3.56,9.65 13.97,9.65 | 13.97,9.65 14.21,9.65 | v16.26,16.76 16.26,16.26 15.75,15.75 15.75,13.46 14.48,12.19 14.48,9.92 U3.3 14.16,9.84 13.97,9.65
VCC_SENSORS  (via drill 0.6)
  Top 0.406: v18.41,31.11 18.67,31.11 18.8,31.24 27.43,31.24 v27.69,31.5 | v25.4,39.37 25.65,39.37 25.91,39.62 33.02,39.62 v33.27,39.37
  Top 0.61: J10.2 J9.6 J8.4 J7.4 J6.2 J5.2 J4.2 J3.2 J2.2 J1.2
  Bottom 0.406: 27.82,31.37 v27.69,31.5 | J1.2 45.09,42.86 44.45,43.5 36.26,43.5 35.05,42.29 35.05,41.12 34.24,40.31 v33.27,39.37 | U2.3 26.35,36.02 26.35,33.66 27.94,32.07 27.94,31.75 v27.69,31.5 | R7.2 28.32,30.86 v27.69,31.5 | v18.41,31.11 16.36,31.11 R8.2 | U2.3 | v25.4,39.37 25.4,38.86 25.91,38.35 25.91,36.46 U2.3
VIN  (via drill 0.6)
  Top 0.305: 32.99,22.94 33.02,22.94 31.6,24.36 R9.1 | 32.99,22.94 33.66,22.28 33.66,20.32 34.92,19.05 34.92,17.14 35.51,16.56 36.75,16.56 37.49,15.82 37.49,10.03 38,9.53 | v30.61,21.72 30.61,21.84 31.88,23.11 32.82,23.11 32.99,22.94
  Top 0.61: 28.57,5.08 JP1.2 30.94,8.08 34.59,8.08 36.04,9.53 38,9.53 42.94,9.53 BATT.1
  Bottom 0.305: R11.2 32.33,23.57 30.92,22.16 30.92,22.04 v30.61,21.72
VIN2  (via drill 0.6)
  Top 0.61: JP1.1 30.8,5.4 36.65,5.4 v38.68,7.43
  pour Bottom (isolate 0.406): 38.1,7.62 38.1,5.08 39.01,5.08 39.01,5.64 41.91,5.64 41.91,4.45 44.81,4.47 44.78,6.4 43.87,6.55 41.1,7.16 40.64,7.62

### Text on the board
tPlace: GND | 3V | 5V | ANT